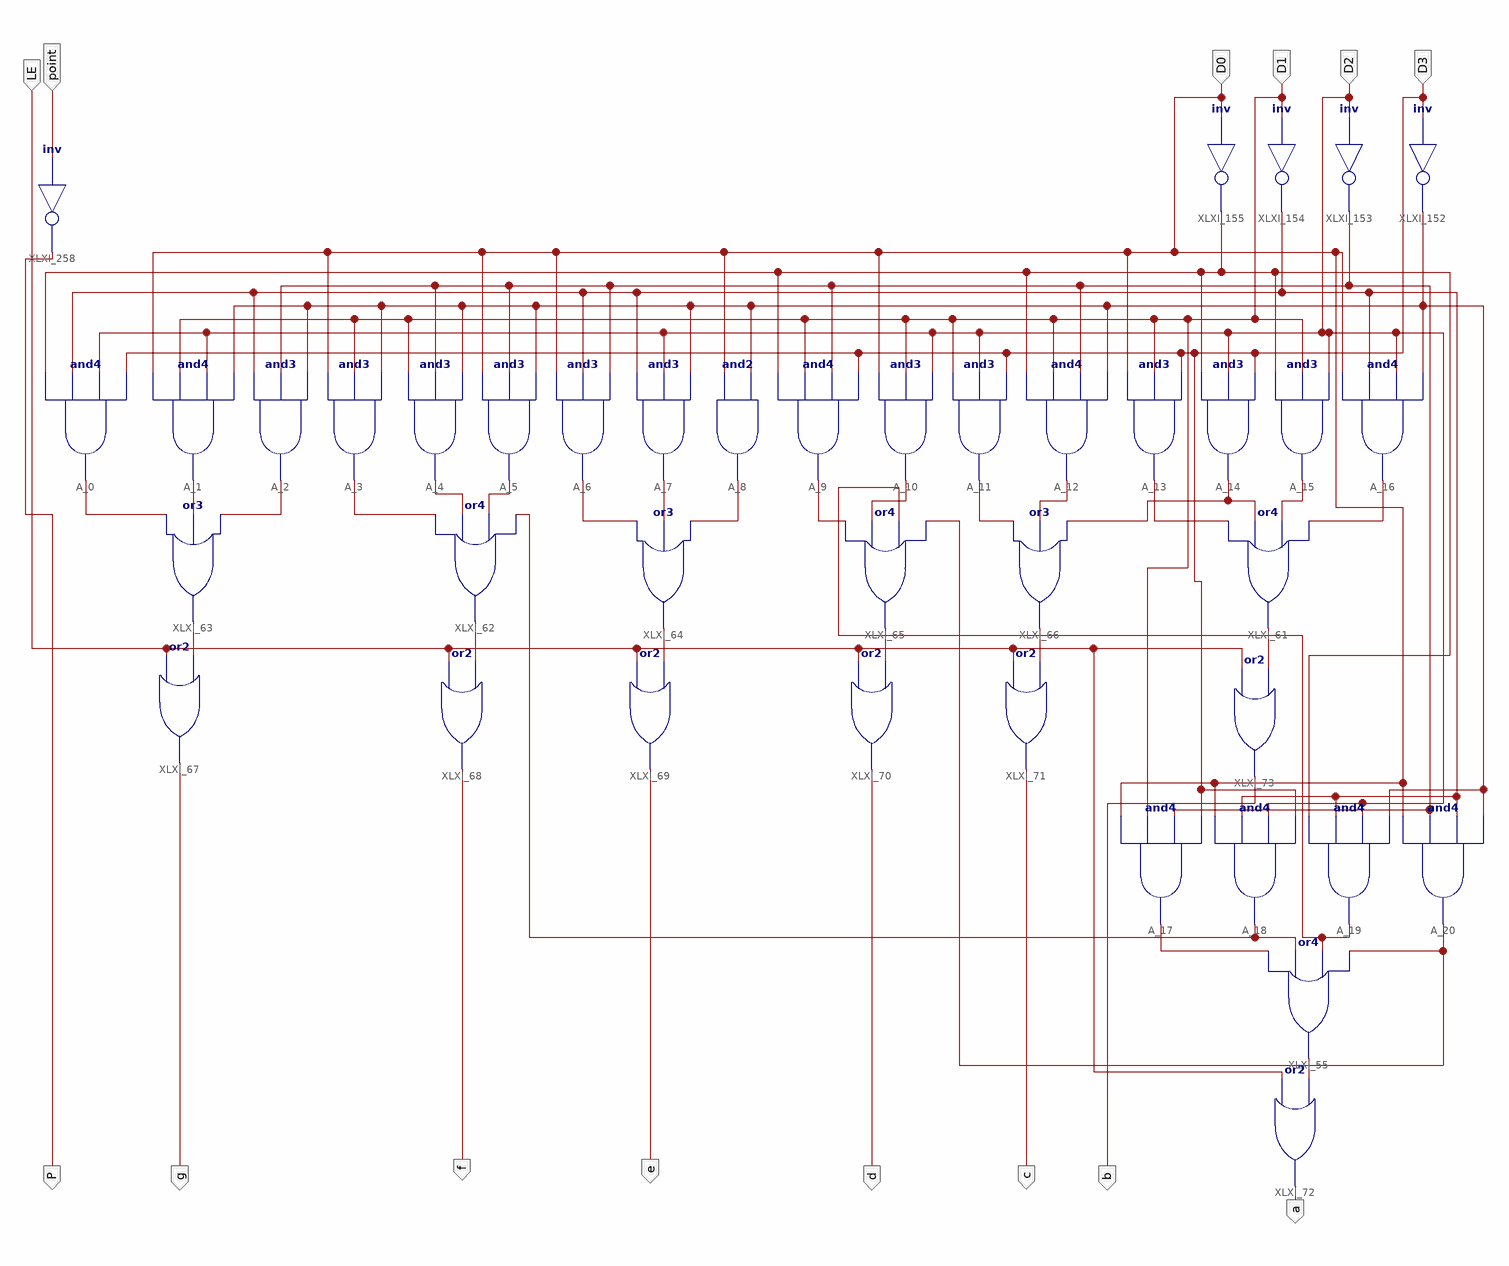
[diagram p0: schematic sheet 1]
// Xilinx ISE schematic MC14495.sch (kintex7) as structural Verilog: 40 symbols, 14 ports
module MC14495 (
  input  D2,
  input  D0,
  input  D1,
  input  D3,
  input  LE,
  input  point,
  output P,
  output g,
  output f,
  output e,
  output d,
  output c,
  output b,
  output a
);

  wire XLXN_7, XLXN_8, XLXN_9, XLXN_10, XLXN_11, XLXN_12, XLXN_13, XLXN_14, XLXN_15, XLXN_16, XLXN_17,
       XLXN_18, XLXN_19, XLXN_20, XLXN_22, XLXN_23, XLXN_24, XLXN_25, XLXN_28, XLXN_29, XLXN_30, XLXN_31,
       XLXN_32, XLXN_33, XLXN_34, XLXN_35, XLXN_36, XLXN_42, XLXN_142, XLXN_145, XLXN_148, XLXN_161;

  and A_1 (XLXN_8, D0, D1, D2, XLXN_148);
  and A_2 (XLXN_9, XLXN_142, XLXN_145, XLXN_148);
  and A_3 (XLXN_10, D0, D1, XLXN_148);
  and A_4 (XLXN_11, D1, XLXN_145, XLXN_148);
  and A_5 (XLXN_12, D0, XLXN_145, XLXN_148);
  and A_8 (XLXN_15, D0, XLXN_148);
  and A_9 (XLXN_16, XLXN_42, D1, XLXN_145, D3);
  and A_10 (XLXN_17, D0, D1, D2);
  and A_11 (XLXN_18, D1, D2, D3);
  and A_12 (XLXN_19, XLXN_42, D1, XLXN_145, XLXN_148);
  and A_13 (XLXN_20, D0, D1, D3);
  and A_14 (XLXN_22, XLXN_42, D2, D3);
  and A_15 (XLXN_23, XLXN_42, D1, D2);
  and A_6 (XLXN_13, D0, XLXN_142, XLXN_145);
  and A_16 (XLXN_24, D0, XLXN_142, D2, XLXN_148);
  and A_0 (XLXN_7, XLXN_42, XLXN_142, D2, D3);
  and A_7 (XLXN_14, XLXN_142, D2, XLXN_148);
  or XLXI_64 (XLXN_33, XLXN_13, XLXN_14, XLXN_15);
  or XLXI_62 (XLXN_34, XLXN_10, XLXN_11, XLXN_12, XLXN_35);
  or XLXI_63 (XLXN_161, XLXN_7, XLXN_8, XLXN_9);
  or XLXI_61 (XLXN_30, XLXN_20, XLXN_22, XLXN_23, XLXN_24);
  or XLXI_73 (b, LE, XLXN_30);
  or XLXI_67 (g, LE, XLXN_161);
  or XLXI_68 (f, LE, XLXN_34);
  or XLXI_69 (e, LE, XLXN_33);
  and A_20 (XLXN_28, D0, XLXN_145, XLXN_142, XLXN_148);
  and A_19 (XLXN_36, XLXN_42, XLXN_142, D2, XLXN_148);
  and A_18 (XLXN_35, D0, XLXN_142, D2, D3);
  and A_17 (XLXN_25, D0, D1, XLXN_145, D3);
  or XLXI_72 (a, LE, XLXN_29);
  or XLXI_55 (XLXN_29, XLXN_25, XLXN_35, XLXN_36, XLXN_28);
  or XLXI_66 (XLXN_31, XLXN_18, XLXN_19, XLXN_22);
  or XLXI_71 (c, LE, XLXN_31);
  or XLXI_65 (XLXN_32, XLXN_16, XLXN_17, XLXN_36, XLXN_28);
  or XLXI_70 (d, LE, XLXN_32);
  not XLXI_152 (XLXN_148, D3);
  not XLXI_153 (XLXN_145, D2);
  not XLXI_154 (XLXN_142, D1);
  not XLXI_155 (XLXN_42, D0);
  not XLXI_258 (P, point);
endmodule
